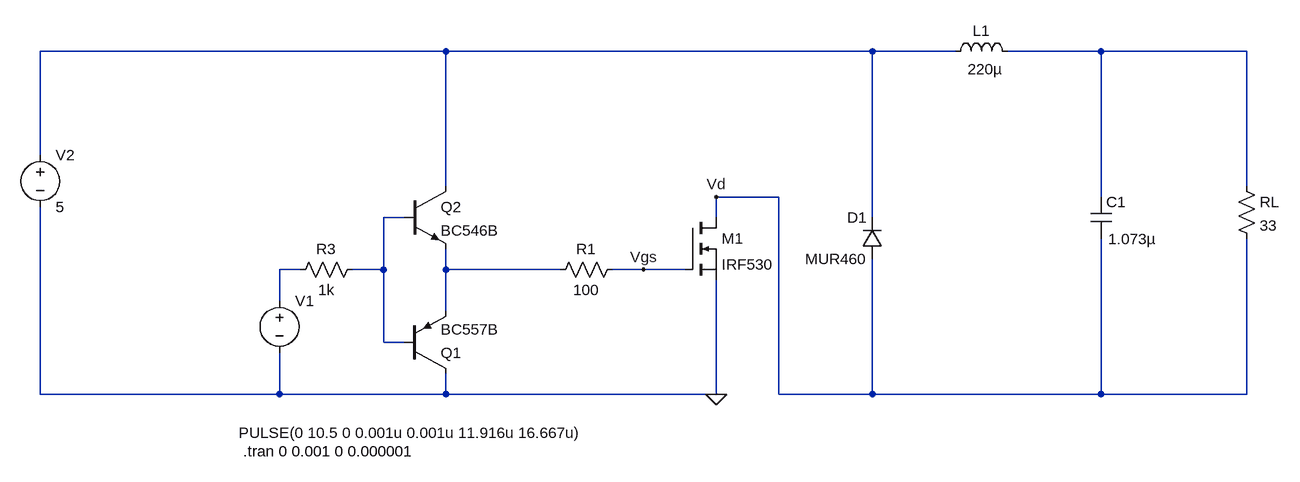
[diagram p0: schematic tp1-pto3.asc]
tp1-pto3.asc, the LTspice schematic file:
Version 4
SHEET 1 1348 744
WIRE 48 112 -576 112
WIRE 704 112 48 112
WIRE 832 112 704 112
WIRE 1056 112 912 112
WIRE 1280 112 1056 112
WIRE -576 272 -576 112
WIRE 48 320 48 112
WIRE 1280 320 1280 112
WIRE 560 336 464 336
WIRE 1056 336 1056 112
WIRE -16 368 -48 368
WIRE 464 368 464 336
WIRE 704 368 704 112
WIRE -176 448 -208 448
WIRE -48 448 -48 368
WIRE -48 448 -96 448
WIRE 48 448 48 416
WIRE 224 448 48 448
WIRE 352 448 304 448
WIRE 416 448 352 448
WIRE -208 496 -208 448
WIRE 48 512 48 448
WIRE -48 560 -48 448
WIRE -16 560 -48 560
WIRE -576 640 -576 352
WIRE -208 640 -208 576
WIRE -208 640 -576 640
WIRE 48 640 48 608
WIRE 48 640 -208 640
WIRE 464 640 464 464
WIRE 464 640 48 640
WIRE 560 640 560 336
WIRE 704 640 704 432
WIRE 704 640 560 640
WIRE 1056 640 1056 400
WIRE 1056 640 704 640
WIRE 1280 640 1280 400
WIRE 1280 640 1056 640
FLAG 464 640 0
FLAG 352 448 Vgs
FLAG 464 336 Vd
SYMBOL nmos 416 368 R0
SYMATTR InstName M1
SYMATTR Value IRF530
SYMBOL res 320 432 R90
WINDOW 0 0 56 VBottom 2
WINDOW 3 32 56 VTop 2
SYMATTR InstName R1
SYMATTR Value 100
SYMBOL pnp -16 608 M180
SYMATTR InstName Q1
SYMATTR Value BC557B
SYMBOL npn -16 320 R0
SYMATTR InstName Q2
SYMATTR Value BC546B
SYMBOL voltage -208 480 R0
WINDOW 123 0 0 Left 2
WINDOW 39 0 0 Left 2
WINDOW 3 -63 219 Left 2
SYMATTR Value PULSE(0 10.5 0 0.001u 0.001u 11.916u 16.667u)
SYMATTR InstName V1
SYMBOL voltage -576 256 R0
WINDOW 123 0 0 Left 2
WINDOW 39 0 0 Left 2
SYMATTR InstName V2
SYMATTR Value 5
SYMBOL res -80 432 R90
WINDOW 0 0 56 VBottom 2
WINDOW 3 32 56 VTop 2
SYMATTR InstName R3
SYMATTR Value 1k
SYMBOL res 1264 304 R0
SYMATTR InstName RL
SYMATTR Value 33
SYMBOL ind 816 128 R270
WINDOW 0 32 56 VTop 2
WINDOW 3 4 62 VBottom 2
SYMATTR InstName L1
SYMATTR Value 220µ
SYMBOL diode 720 432 R180
WINDOW 0 24 64 Left 2
WINDOW 3 24 0 Left 2
SYMATTR InstName D1
SYMATTR Value MUR460
SYMBOL cap 1040 336 R0
WINDOW 3 27 65 Left 2
SYMATTR Value 1.073µ
SYMATTR InstName C1
SYMATTR SpiceLine Rser=1
TEXT -264 728 Left 2 !.tran 0 0.001 0 0.000001

The netlist it stands for:
* tp1-pto3.asc
M1 Vd Vgs 0 0 IRF530
R1 Vgs N005 100
Q1 0 N003 N005 0 BC557B
Q2 N001 N003 N005 0 BC546B
V1 N004 0 PULSE(0 10.5 0 0.001u 0.001u 11.916u 16.667u)
V2 N001 0 5
R3 N003 N004 1k
RL N002 Vd 33
L1 N001 N002 220µ
D1 Vd N001 MUR460
C1 N002 Vd 1.073µ Rser=1
.model D D
.lib standard.dio
.model NPN NPN
.model PNP PNP
.lib standard.bjt
.model NMOS NMOS
.model PMOS PMOS
.lib standard.mos
.tran 0 0.001 0 0.000001
.backanno
.end

* Results of the author's LTspice run, read from the files saved beside the schematic
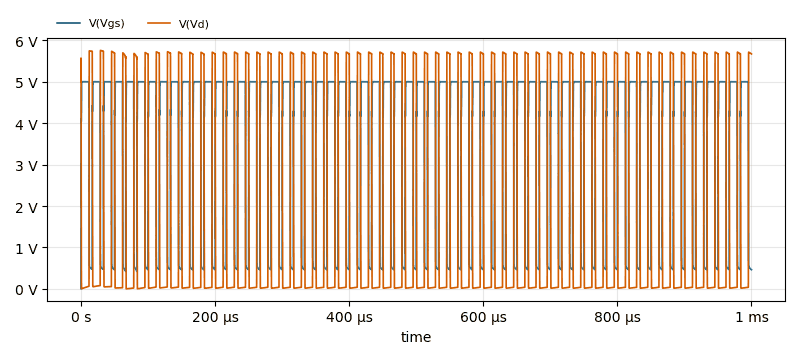
[diagram p1: Transient Analysis of tp1-pto3.asc, plotted from the saved traces]
* Transient Analysis, 1 run:
*   V(Vgs): min 5.219 mV, max 5.002 V, average 3.727 V, rms 4.216 V, last 460.9 mV
*   V(Vd): min 1.568 mV, max 5.758 V, average 1.721 V, rms 3.074 V, last 5.671 V